# EAGLE design Microphone (EAGLE 7.2.0)
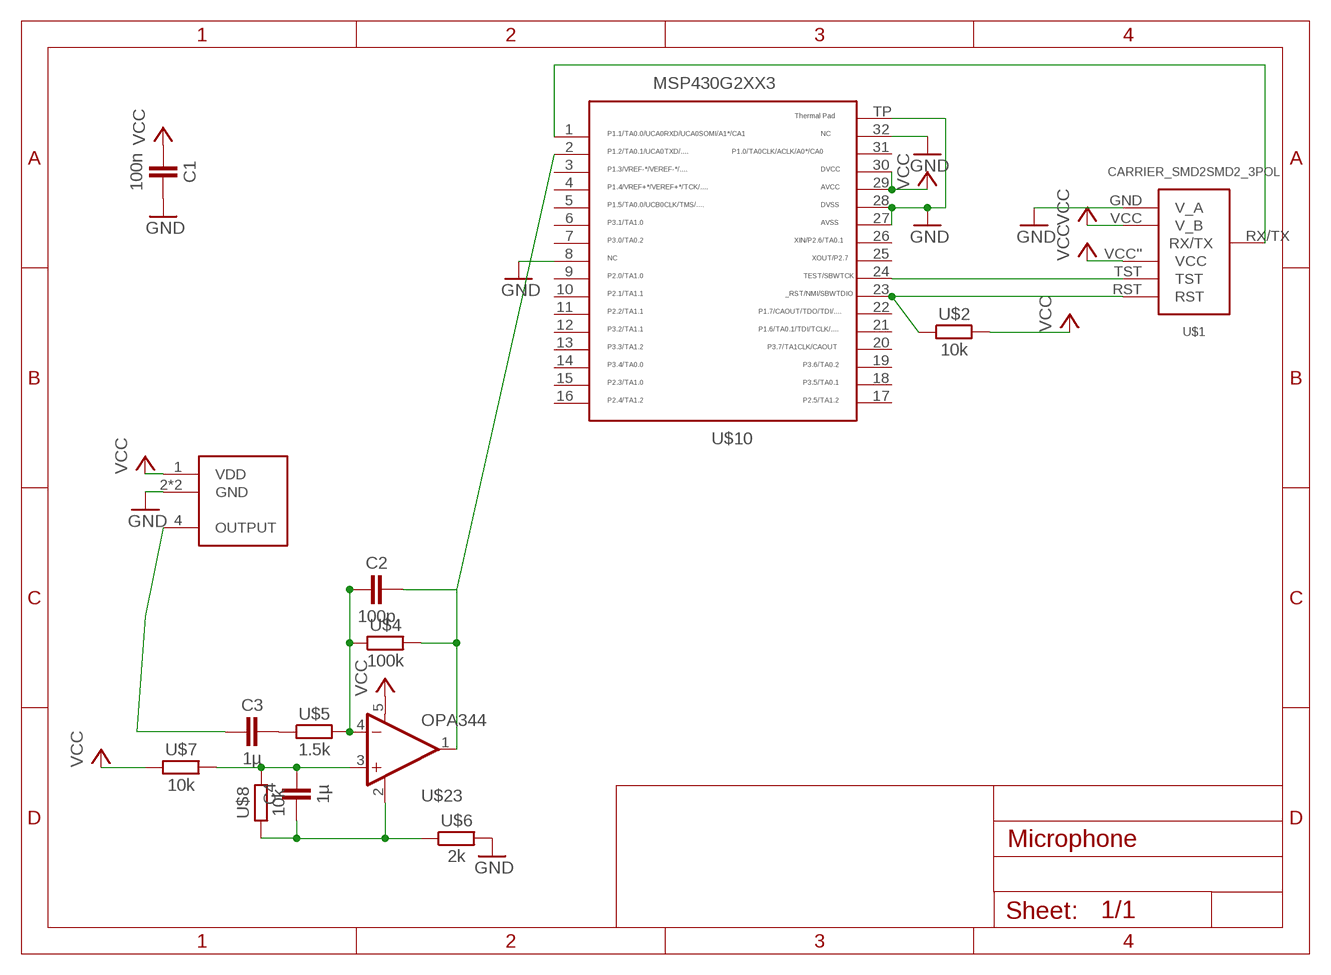
[diagram p0: schematic, sheet 1]

## Parts
C1  100n  CAPACITOR  [603]
C2  100p  CAPACITOR  [603]
C3  1µ  CAPACITOR  [603]
C4  1µ  CAPACITOR  [603]
U$1  CARRIER_SMD2SMD2_3POL  [CARRIER_SMD2_3POL]
U$2  10k  RESISTOR0603  [603]
U$4  100k  RESISTOR0603  [603]
U$5  1.5k  RESISTOR0603  [603]
U$6  2k  RESISTOR0603  [603]
U$7  10k  RESISTOR0603  [603]
U$8  10k  RESISTOR0603  [603]
U$10  MSP430G2553  [QFN32]
U$23  OPA344  [SOT23-5]
U$25  WM7120A  [WM7120A]

## Nets
GND: C1.2 U$1.GND(V_A) U$6.2 U$10.8 U$10.27 U$10.28 U$10.32 U$10.TP U$25.2(GND) U$25.3(GND)
N$2: C3.1 U$25.4(OUTPUT)
N$3: U$1.TST U$10.24
N$4: U$1.RST U$2.1 U$10.23
N$12: U$1.RX/TX U$10.1
N$52: C2.1 U$4.1 U$5.2 U$23.4(-IN)
N$53: C3.2 U$5.1
N$55: C4.1 U$6.1 U$8.1 U$23.2(V-)
N$57: C4.2 U$7.2 U$8.2 U$23.3(+IN)
SOUND: C2.2 U$4.2 U$10.2 U$23.1(OUT)
VCC: C1.1 U$1.VCC''(VCC) U$1.VCC(V_B) U$2.2 U$7.1 U$10.29 U$10.30 U$23.5(V+) U$25.1(VDD)
Unconnected: U$10.3 U$10.4 U$10.5 U$10.6 U$10.7 U$10.9 U$10.10 U$10.11 U$10.12 U$10.13 U$10.14 U$10.15 U$10.16 U$10.17 U$10.18 U$10.19 U$10.20 U$10.21 U$10.22 U$10.25 U$10.26 U$10.31

## Library data of the parts
C1-C4 = thar:CAPACITOR
U$1 = thar:CARRIER_SMD2
U$2 U$4-U$8 = thar:RESISTOR
U$10 = thar:MSP430G2553: TEXAS INSTRUMENTS MSP430G2553IRHB32R MCU, 16BIT, MSP430, 16MHZ, QFN-32 Farnell Best.Nr.: 2325726 Herst.Bez.: MSP430G2553IRHB32R
U$23 = SparkFun-AnalogIC:OPA344: Single gate rail-to-rail output op-amp. Inputs extend 300mV past rails.
U$25 = thar:WM7120A: WOLFSON MICROELECTRONICS - WM7120AIMS/RV - IC, MIKROFON, MEMS, ANALOG E Farnell Best.Nr.: 2077892 Herst.Bez.: WM7120AIMS/RV

## Board
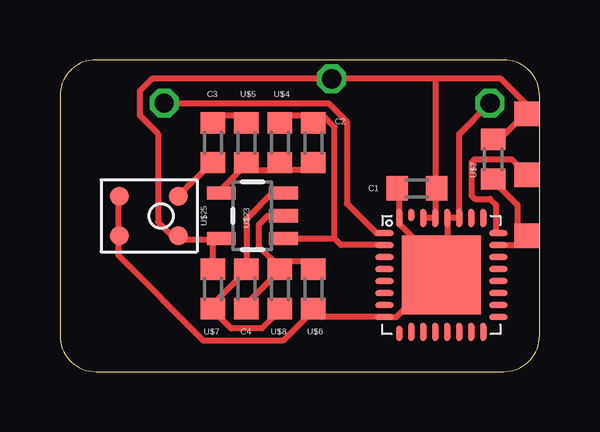
[diagram p1: board, top side]
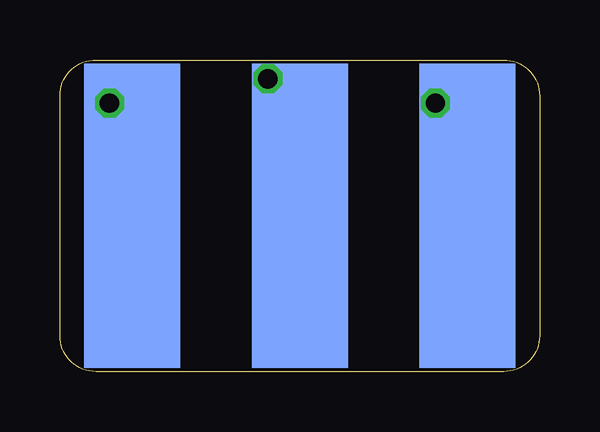
[diagram p2: board, bottom side, seen from below]

Size 20 x 13 mm. Coordinates in mm from the lower left corner, seen from the top.
Copper layers (1*16): Top 0.035mm / dielectric 1.5mm / Bottom 0.035mm
Design rules "Bilex DRU *": minimum track width 10mil, minimum drill 24mil, track to track 10mil, track to pad 10mil, pad to pad 10mil, via to via 10mil, smd to smd 10mil, copper to edge 1mil, drill to drill 8mil, minimum pad ring 10mil, minimum via ring 8mil, stop-mask expansion 4mil, vias tented up to drill 0mil, thermal gap 10mil

### Footprints (pad centres in the part's own frame; a part is rotated, then mirrored left to right if it is on the bottom)
603 = smd 0.889 x 1.016: 1 -0.826,0; 2 0.826,0
CARRIER_SMD2_3POL = smd 4 x 12.7 bottom: GND -6.985,0; RX/TX 6.985,0; VCC 0,0 | smd 1.016 x 1.016: RST -9.461,0.826; TST -9.461,-1.714; VCC'' -9.461,-4.255
QFN32 = smd 0.762 x 0.254: 1 -2.375,1.75; 2 -2.375,1.25; 3 -2.375,0.75; 4 -2.375,0.25; 5 -2.375,-0.25; 6 -2.375,-0.75; 7 -2.375,-1.25; 8 -2.375,-1.75; 17 2.375,-1.75; 18 2.375,-1.25; 19 2.375,-0.75; 20 2.375,-0.25; 21 2.375,0.25; 22 2.375,0.75; 23 2.375,1.25; 24 2.375,1.75 | smd 0.254 x 0.635: 9 -1.75,-2.438 | smd 0.254 x 0.762: 10 -1.25,-2.375; 11 -0.75,-2.375; 12 -0.25,-2.375; 13 0.25,-2.375; 14 0.75,-2.375; 15 1.25,-2.375; 16 1.75,-2.375; 25 1.75,2.375; 26 1.25,2.375; 27 0.75,2.375; 28 0.25,2.375; 29 -0.25,2.375; 30 -0.75,2.375; 32 -1.75,2.375 | smd 0.254 x 0.508: 31 -1.25,2.5 | smd 3.302 x 3.302: TP 0,0
SOT23-5 = smd 0.55 x 1.2: 1 -0.95,-1.3; 2 0,-1.3; 3 0.95,-1.3; 4 0.95,1.3; 5 -0.95,1.3
WM7120A = smd 0.8 x 0.8: 1 0.825,1.23; 2 0.825,-1.23; 3 -0.825,-1.23; 4 -0.825,1.23

### Placement (x,y rotation side)
C1  14.89,7.64 180 top
C2  10.57,9.54 90 top
C3  6.38,9.54 90 top
C4  7.78,3.45 90 top
U$1  10,6.5 180 top
U$2  18.06,8.86 90 top
U$4  9.17,9.54 90 top
U$5  7.78,9.54 270 top
U$6  10.57,3.45 270 top
U$7  6.38,3.45 270 top
U$8  9.17,3.45 270 top
U$10  15.9,4.03 0 top
U$23  8.03,6.5 90 top
U$25  3.71,6.5 270 top

### Tracks (layer width: path | path; a pad name or v marks a point on that pad's centre or on a via)
GND  (via drill 0.8)
  Top 0.254: 16.43,4.35 16.19,5.38 16.16,5.35 | 16.43,4.35 16.48,3.06 U$10.TP 15.01,2.94 14.89,3.14 14.03,2.28 U$10.8 10.91,2.28 U$6.2 10.57,2.56 9.3,1.29 6,1.29 2.44,4.85 2.44,5.61 | 16.15,4.72 U$10.28 U$10.27 16.65,9.91 v17.93,11.2 | 16.15,4.72 16.15,4.42 16.43,4.35 | 16.15,4.72 15.52,5.35 14.76,5.55 14.15,6.16 U$10.32 14.15,7.49 14,7.71 14.12,7.7 C1.2 14.06,7.51 | 2.44,5.61 2.44,5.63 | 2.44,5.63 U$25.2 2.48,5.65 2.44,5.61 | 2.44,5.63 2.44,7.28 U$25.3
  Bottom 0.254: 18,6.5 17.93,6.57 v17.93,11.2 16.98,10.25 U$1.GND
N$2
  Top 0.254: C3.1 6.21,8.6 U$25.4
N$3
  Top 0.254: 19.61,7.88 19.46,8.02 19.5,8.18 U$1.TST | U$10.24 18.19,5.78 18.19,6.95 17.93,7.21 17.3,7.21 17.17,7.33 17.17,8.73 17.3,8.86 18.82,8.86 19.43,8.25 U$1.TST | U$1.TST
N$4
  Top 0.254: 19.46,5.48 19.5,5.38 | 19.46,5.48 19.5,5.69 | 19.5,5.69 19.08,5.74 19.08,6.95 18.06,7.97 U$2.1 | U$10.23 19.28,5.28 19.46,5.48 | 19.5,5.69 19.48,5.69 U$1.RST
N$12  (via drill 0.8)
  Top 0.254: U$10.1 13.19,5.78 11.97,7.01 11.97,10.43 11.2,11.2 6.25,11.2 v4.35,11.2
  Bottom 0.254: 2.76,7.77 v4.35,11.2 3.01,9.87 U$1.RX/TX
N$52
  Top 0.254: C2.1 10.7,8.66 10.7,8.4 9.24,8.4 | 8.85,8.4 U$4.1 9.24,8.4 | 7.52,8.4 8.85,8.4 | 8.85,8.4 9.24,8.4 | U$5.2 7.52,8.4 | 7.52,8.4 6.63,7.51 6.79,7.51 U$23.4
N$53
  Top 0.254: C3.2 6.38,10.69 7.46,10.69 U$5.1
N$55
  Top 0.254: U$23.2 8.66,6.5 8.28,6.12 8.28,5.23 9.17,4.34 U$8.1 | U$6.1 10.57,4.59 9.49,4.59 U$8.1 | U$8.1 9.17,4.21 7.78,2.81 C4.1
N$57
  Top 0.254: U$23.3 8.85,7.45 7.78,6.37 C4.2 7.78,4.21 6.38,2.81 U$7.2 6.38,2.56 7.14,1.8 8.41,1.8 9.17,2.56 U$8.2
SOUND
  Top 0.254: U$4.2 9.04,10.69 10.63,10.69 | 10.63,10.69 C2.2 | 11.46,5.55 11.46,10.18 10.95,10.69 10.63,10.69 | U$10.2 11.72,5.28 11.46,5.55 | U$23.1 11.46,5.55
VCC  (via drill 0.8)
  Top 0.254: U$10.29 | 15.65,12.21 15.65,8.02 | 15.65,8.02 U$10.29 | 15.65,7.64 15.59,7.89 | 15.59,7.89 15.65,8.02 | U$10.29 U$10.30 | C1.1 15.59,7.89 | 19.5,10.52 19.46,10.56 | U$2.2 18.12,9.48 19.2,10.56 19.2,10.51 19.46,10.56 | 19.65,10.81 19.65,10.95 18.39,12.21 15.65,12.21 | 19.65,10.81 19.65,10.75 19.46,10.56 | 15.65,12.21 v11.33,12.21 3.84,12.21 3.33,11.7 3.33,10.69 4.09,9.93 4.09,6.24 4.85,5.48 4.99,5.47 4.99,5.48 | U$23.5 6.7,5.55 6.63,5.48 6.38,5.48 | 6.38,5.48 4.99,5.48 | U$7.1 6.38,5.48 | U$25.1 4.94,5.48 4.99,5.48 | U$1.VCC'' 19.59,10.76 19.65,10.81
  Bottom 0.254: U$1.VCC 10,10.88 v11.33,12.21